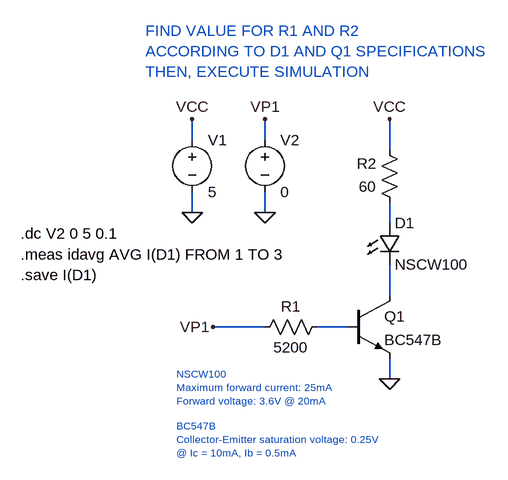
[diagram p0: schematic LED_driver.asc]
LED_driver.asc, the LTspice schematic file:
Version 4
SHEET 1 880 680
WIRE -64 -112 -64 -144
WIRE 48 -112 48 -144
WIRE 240 -96 240 -144
WIRE -64 0 -64 -32
WIRE 48 0 48 -32
WIRE 240 16 240 -16
WIRE 240 128 240 80
WIRE 48 176 -32 176
WIRE 176 176 128 176
WIRE 240 256 240 224
FLAG 240 256 0
FLAG 240 -144 VCC
FLAG -32 176 VP1
FLAG -64 0 0
FLAG 48 0 0
FLAG -64 -144 VCC
FLAG 48 -144 VP1
SYMBOL npn 176 128 R0
SYMATTR InstName Q1
SYMATTR Value BC547B
SYMBOL res 144 160 R90
WINDOW 0 0 56 VBottom 2
WINDOW 3 32 56 VTop 2
SYMATTR InstName R1
SYMATTR Value 5200
SYMBOL res 256 0 R180
WINDOW 0 36 76 Left 2
WINDOW 3 36 40 Left 2
SYMATTR InstName R2
SYMATTR Value 60
SYMBOL LED 224 16 R0
SYMATTR InstName D1
SYMATTR Value NSCW100
SYMATTR Description Diode
SYMATTR Type diode
SYMBOL voltage -64 -128 R0
WINDOW 123 0 0 Left 0
WINDOW 39 0 0 Left 0
SYMATTR InstName V1
SYMATTR Value 5
SYMBOL voltage 48 -128 R0
SYMATTR InstName V2
SYMATTR Value 0
TEXT -88 248 Left 1 ;NSCW100\nMaximum forward current: 25mA\nForward voltage: 3.6V @ 20mA
TEXT -88 328 Left 1 ;BC547B\nCollector-Emitter saturation voltage: 0.25V\n@ Ic = 10mA, Ib = 0.5mA
TEXT -136 -280 Left 2 ;FIND VALUE FOR R1 AND R2\nACCORDING TO D1 AND Q1 SPECIFICATIONS\nTHEN, EXECUTE SIMULATION
TEXT -328 32 Left 2 !.dc V2 0 5 0.1
TEXT -328 64 Left 2 !.meas idavg AVG I(D1) FROM 1 TO 3
TEXT -328 96 Left 2 !.save I(D1)

The netlist it stands for:
* LED_driver.asc
Q1 N002 N003 0 0 BC547B
R1 N003 VP1 5200
R2 N001 VCC 60
D1 N001 N002 NSCW100
V1 VCC 0 5
V2 VP1 0 0
.model D D
.lib standard.dio
.model NPN NPN
.model PNP PNP
.lib standard.bjt
* NSCW100
* Maximum forward current: 25mA
* Forward voltage: 3.6V @ 20mA
* BC547B
* Collector-Emitter saturation voltage: 0.25V
* @ Ic = 10mA, Ib = 0.5mA
* FIND VALUE FOR R1 AND R2
* ACCORDING TO D1 AND Q1 SPECIFICATIONS
* THEN, EXECUTE SIMULATION
.dc V2 0 5 0.1
.meas idavg AVG I(D1) FROM 1 TO 3
.save I(D1)
.backanno
.end